# EAGLE design R3D2_long_range (EAGLE 7.4.0)
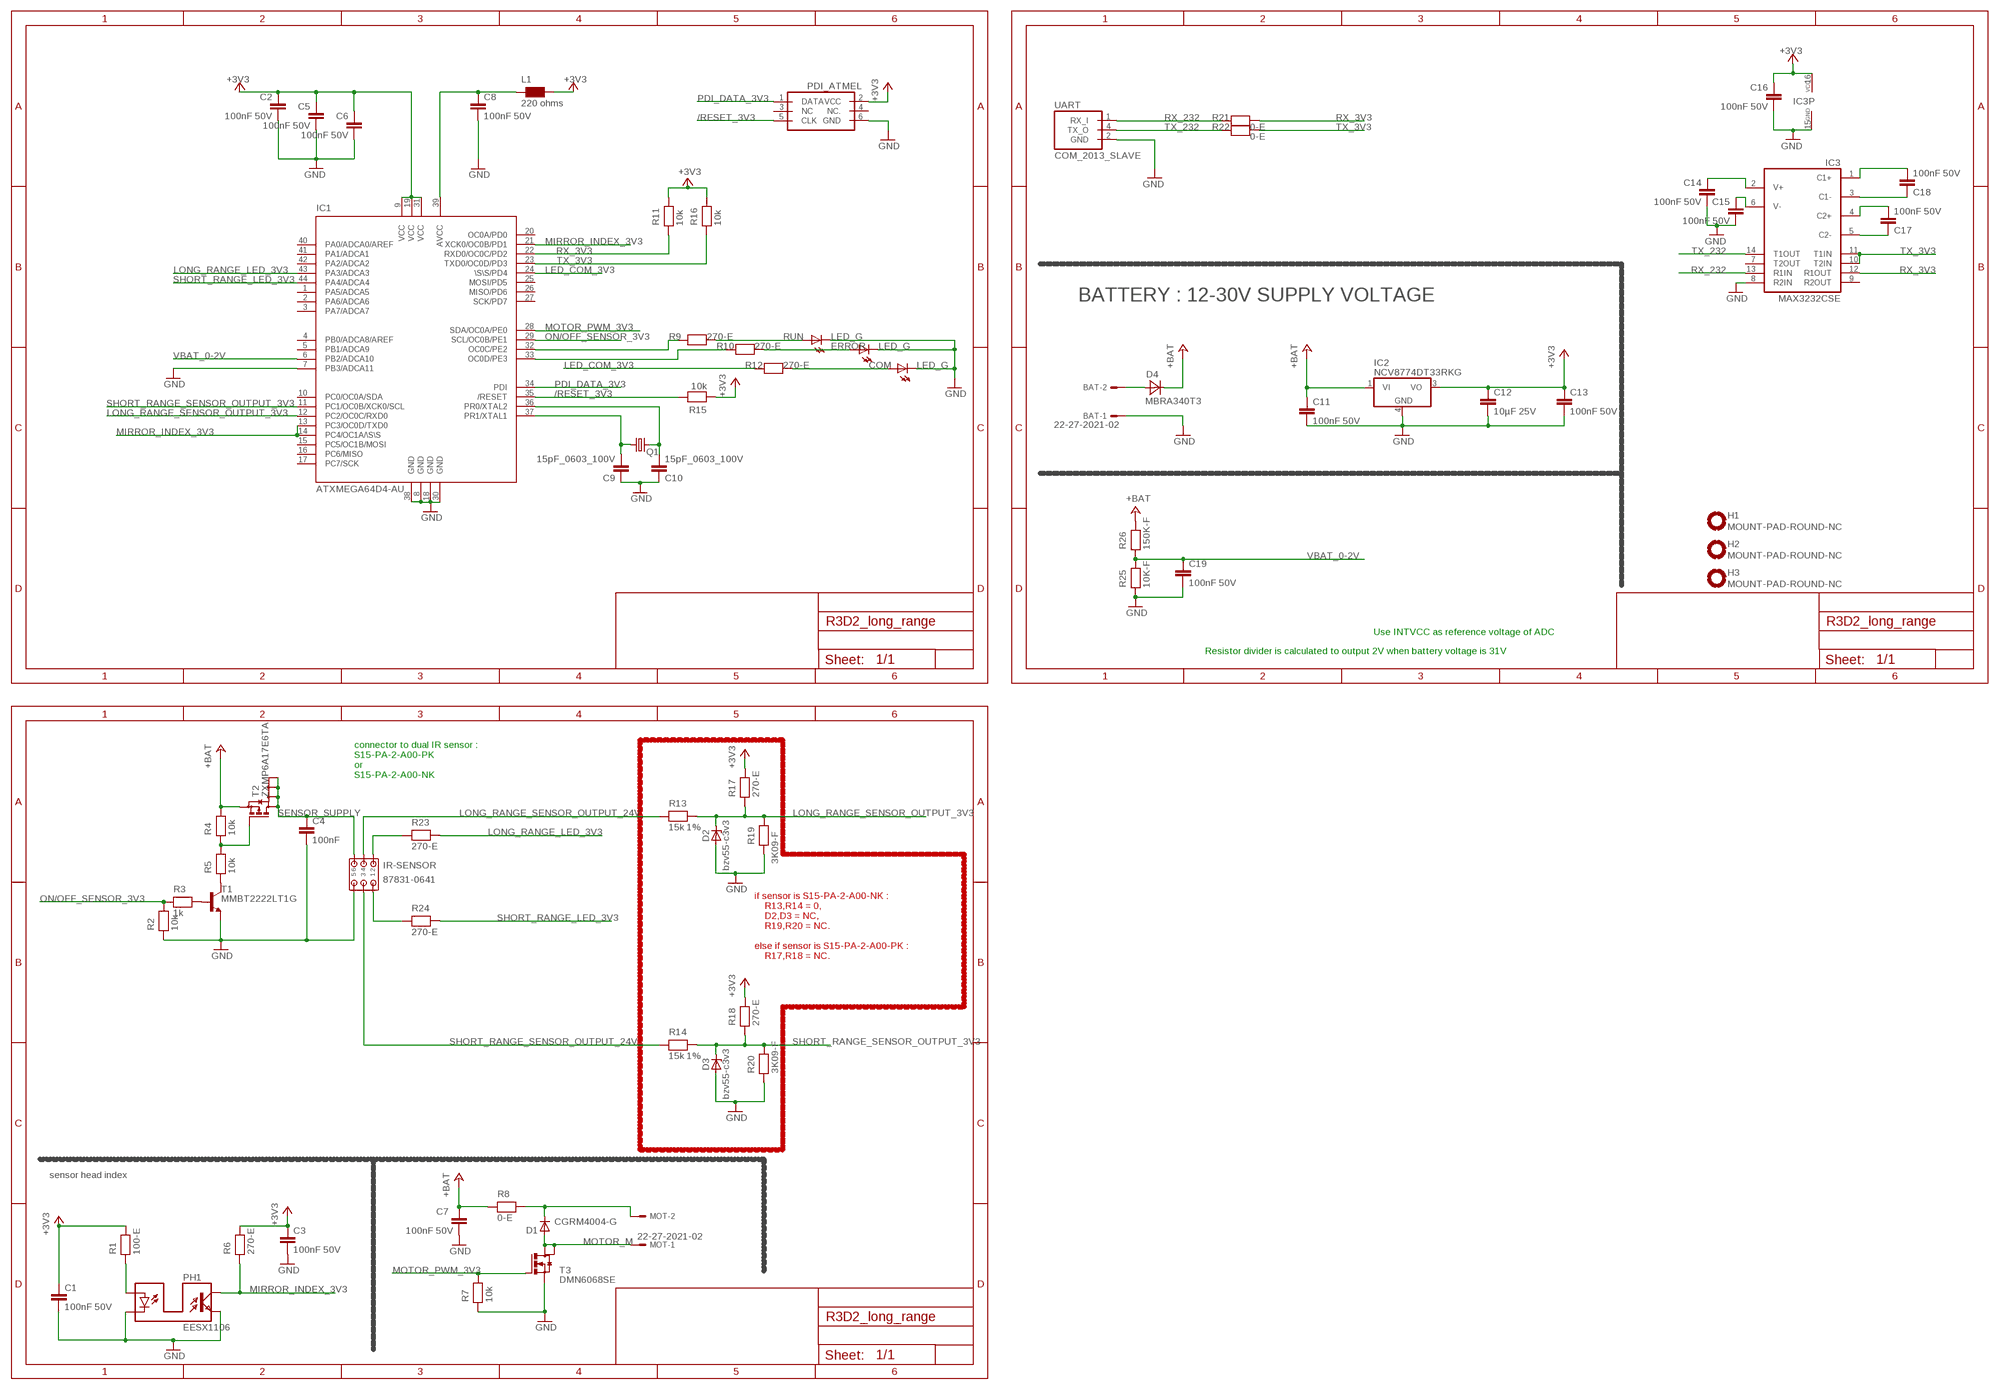
[diagram p0: schematic, sheet 1]

## Parts
BAT  22-27-2021-02  [6410-02]
C1  100nF 50V  100NF-F  [C0603]
C2  100nF 50V  100NF-F  [C0603]
C3  100nF 50V  100NF-F  [C0603]
C4  100nF  100NF-F  [C0603]
C5  100nF 50V  100NF-F  [C0603]
C6  100nF 50V  100NF-F  [C0603]
C7  100nF 50V  100NF-F  [C0603]
C8  100nF 50V  100NF-F  [C0603]
C9  15pF_0603_100V  15PF-F  [C0603]
C10  15pF_0603_100V  15PF-F  [C0603]
C11  100nF 50V  100NF-E  [C0805]
C12  10µF 25V  10UF-C_25V  [C1210]
C13  100nF 50V  100NF-F  [C0603]
C14  100nF 50V  100NF-F  [C0603]
C15  100nF 50V  100NF-F  [C0603]
C16  100nF 50V  100NF-F  [C0603]
C17  100nF 50V  100NF-F  [C0603]
C18  100nF 50V  100NF-F  [C0603]
C19  100nF 50V  100NF-E  [C0805]
COM  LED_G  [CHIP-LED0805]
D1  CGRM4004-G  [SOD-123_MINI-SMA]
D2  bzv55-c3v3  BZV55-C3V3SOD80C  [SOD80C]
D3  bzv55-c3v3  BZV55-C3V3SOD80C  [SOD80C]
D4  MBRA340T3  [SMA]
ERROR  LED_G  [CHIP-LED0805]
H1  MOUNT-PAD-ROUND-NC  [3,0-PAD_NC]
H2  MOUNT-PAD-ROUND-NC  [3,0-PAD_NC]
H3  MOUNT-PAD-ROUND-NC  [3,0-PAD_NC]
IC1  ATXMEGA64D4-AU  [TQFP44]
IC2  NCV8774DT33RKG  [DPACK_3]
IC3  MAX3232CSE  [SO16]
IR-SENSOR  87831-0641  [87831-0641]
L1  220 ohms  FERRITE_220OHMS  [R0603]
MOT  22-27-2021-02  [6410-02]
PDI_ATMEL  PDI_ATMELL  [ML6L]
PH1  EESX1106  [EESX1106]
Q1  CRYSTAL_16MHZ_5032  [CRYSTAL_5032]
R1  100-E  [R0805]
R2  10k  10K-F  [R0603]
R3  1k  1K-F  [R0603]
R4  10k  10K-F  [R0603]
R5  10k  10K-F  [R0603]
R6  270-E  [R0805]
R7  10k  10K-F  [R0603]
R8  0-E  [R0805]
R9  270-E  [R0805]
R10  270-E  [R0805]
R11  10k  10K-F  [R0603]
R12  270-E  [R0805]
R13  15k 1%  15K-F  [R0603]
R14  15k 1%  15K-F  [R0603]
R15  10k  10K-F  [R0603]
R16  10k  10K-F  [R0603]
R17  270-E  [R0805]
R18  270-E  [R0805]
R19  3K09-F  [R0603]
R20  3K09-F  [R0603]
R21  0-E  [R0805]
R22  0-E  [R0805]
R23  270-E  [R0805]
R24  270-E  [R0805]
R25  10K-F  [R0603]
R26  150K-F  [R0603]
RUN  LED_G  [CHIP-LED0805]
T1  MMBT2222LT1G  MMBT2222ALT1-NPN-SOT23-BEC  [SOT23-BEC]
T2  ZXMP6A17E6TA  [SOT26]
T3  DMN6068SE  [SOT223]
UART  COM_2013_SLAVE  [MICROMATCH-4_SMD]

## Nets
+3V3: C1.1 C2.1 C3.1 C5.1 C6.1 C12.1 C13.1 C16.1 IC1.9(VCC) IC1.19(VCC) IC1.31(VCC) IC2.3(VO) IC3.16(VCC) L1.2 PDI_ATMEL.2(VCC) R1.2 R6.2 R11.2 R15.1 R16.2 R17.2 R18.2
+24V: C7.1 C11.1 D4.C IC2.1(VI) R4.2 R8.1 R26.2 T2.4(S) ; supply symbol labelled +BAT
/RESET_3V3: IC1.35(/RESET) PDI_ATMEL.5(CLK) R15.2
GND: BAT.1 C1.2 C2.2 C3.2 C4.2 C5.2 C6.2 C7.2 C8.2 C9.1 C10.1 C11.2 C12.2 C13.2 C14.2 C15.2 C16.2 C19.2 COM.C D2.A D3.A ERROR.C IC1.7(PB3/ADCA11) IC1.8(GND) IC1.18(GND) IC1.30(GND) IC1.38(GND) IC2.4(GND) IC3.8(R2IN) IC3.15(GND) IR-SENSOR.5 PDI_ATMEL.6(GND) PH1.E(TRANSISTOR_E) PH1.K(LED_C) R2.1 R7.1 R19.1 R20.1 R25.1 RUN.C T1.E T3.3(S) UART.2(GND)
LED_COM_3V3: IC1.24(\S\S/PD4) R12.1
LONG_RANGE_LED_3V3: IC1.43(PA3/ADCA3) R23.2
LONG_RANGE_SENSOR_OUTPUT_3V3: D2.C IC1.12(PC2/OC0C/RXD0) R13.2 R17.1 R19.2
LONG_RANGE_SENSOR_OUTPUT_24V: IR-SENSOR.4 R13.1
MIRROR_INDEX_3V3: IC1.13(PC3/OC0D/TXD0) IC1.14(PC4/OC1A/\S\S) IC1.21(XCK0/OC0B/PD1) PH1.C(TRANSISTOR_C) R6.1
MOTOR_M: D1.A MOT.1 T3.2(D) T3.4(D)
MOTOR_PWM_3V3: IC1.28(SDA/OC0A/PE0) R7.2 T3.1(G)
N$1: C18.1 IC3.1(C1+)
N$2: R9.2 RUN.A
N$3: D1.C MOT.2 R8.2
N$4: ERROR.A R10.2
N$5: C18.2 IC3.3(C1-)
N$6: C17.1 IC3.4(C2+)
N$7: COM.A R12.2
N$8: BAT.2 D4.A
N$9: IC1.32(OC0C/PE2) R9.1
N$10: IC1.33(OC0D/PE3) R10.1
N$11: C14.1 IC3.2(V+)
N$13: C15.1 IC3.6(V-)
N$14: C10.2 IC1.36(PR0/XTAL2) Q1.2
N$15: PH1.A(LED_A) R1.1
N$16: C8.1 IC1.39(AVCC) L1.1
N$17: IR-SENSOR.2 R23.1
N$18: IR-SENSOR.1 R24.1
N$24: C17.2 IC3.5(C2-)
N$45: C9.2 IC1.37(PR1/XTAL1) Q1.1
N$113: R3.2 T1.B
N$126: R5.1 T1.C
N$128: R4.1 R5.2 T2.3(G)
ON/OFF_SENSOR_3V3: IC1.29(SCL/OC0B/PE1) R2.2 R3.1
PDI_DATA_3V3: IC1.34(PDI) PDI_ATMEL.1(DATA)
RX_3V3: IC1.22(RXD0/OC0C/PD2) IC3.12(R1OUT) R11.1 R21.2
RX_232: IC3.13(R1IN) R21.1 UART.1(RX_I)
SENSOR_SUPPLY: C4.1 IR-SENSOR.6 T2.1(D) T2.2(D) T2.5(D) T2.6(D)
SHORT_RANGE_LED_3V3: IC1.44(PA4/ADCA4) R24.2
SHORT_RANGE_SENSOR_OUTPUT_3V3: D3.C IC1.11(PC1/OC0B/XCK0/SCL) R14.2 R18.1 R20.2
SHORT_RANGE_SENSOR_OUTPUT_24V: IR-SENSOR.3 R14.1
TX_3V3: IC1.23(TXD0/OC0D/PD3) IC3.10(T2IN) IC3.11(T1IN) R16.1 R22.2
TX_232: IC3.14(T1OUT) R22.1 UART.4(TX_O)
VBAT_0-2V: C19.1 IC1.6(PB2/ADCA10) R25.2 R26.1
Unconnected: IC1.1(PA5/ADCA5) IC1.2(PA6/ADCA6) IC1.3(PA7/ADCA7) IC1.4(PB0/ADCA8/AREF) IC1.5(PB1/ADCA9) IC1.10(PC0/OC0A/SDA) IC1.15(PC5/OC1B/MOSI) IC1.16(PC6/MISO) IC1.17(PC7/SCK) IC1.20(OC0A/PD0) IC1.25(MOSI/PD5) IC1.26(MISO/PD6) IC1.27(SCK/PD7) IC1.40(PA0/ADCA0/AREF) IC1.41(PA1/ADCA1) IC1.42(PA2/ADCA2) IC3.7(T2OUT) IC3.9(R2OUT) PDI_ATMEL.3(NC) PDI_ATMEL.4(NC.)

## Notes on the sheet
- BATTERY : 12-30V SUPPLY VOLTAGE
- Use INTVCC as reference voltage of ADC
- Resistor divider is calculated to output 2V when battery voltage is 31V
- connector to dual IR sensor :
  S15-PA-2-A00-PK
  or 
  S15-PA-2-A00-NK
- if sensor is S15-PA-2-A00-NK :
      R13,R14 = 0,
      D2,D3 = NC,
      R19,R20 = NC.
  
  else if sensor is S15-PA-2-A00-PK :
      R17,R18 = NC.
- sensor head index

## Library data of the parts
BAT MOT = robotter_connector:22-?-02: CONNECTOR wire to board 2.54 mm (.1 inch) pitch header; MOUSER: 538-22-27-2021; RS: 483-8461
C1-C3 C5-C8 C13-C18 = robotter_capacitor:100NF; MOUSER: 81-GRM188F51H104ZA01; RS: 723-5534
C4 = robotter_capacitor:100NF; MOUSER: 81-GRM188F51H104ZA01; RS: 723-5534; VALUE: 100nF 50V
C9 C10 = robotter_capacitor:15PF; MOUSER: 581-06031A150K4T2A; RS: 147-421
C11 C19 = robotter_capacitor:100NF; MOUSER: 81-GRM40Y104Z50D; RS: 220-7966
C12 = robotter_capacitor:10UF; MOUSER: 963-TMK316BJ106KL-T; RS: 766-1185
COM ERROR RUN = robotter_diode:LED_; MOUSER: 859-LTST-C171GKT; RS: 692-0935; VALUE: GREEN
D1 = robotter_diode:CGRM400*-G: Molded plasitc,JEDEC SOD-123/Mini SMA Source: Comchip CGRM4001-G.pdf; MOUSER: 863-MRA4004T3G; RS: 545-2456; VALUE: MRA4004T3G
D2 D3 = robotter_diode:BZV55-C3V3: Z-Diode; MOUSER: 771-BZV55-C3V3T/R; RS: 748-5029
D4 = robotter_diode:MBRA340T3: Surface Mount Schottky Power Rectifier Source: http://www.onsemi.com/pub_link/Collateral/MBRA340T3-D.PDF; MOUSER: 863-MBRA340T3G; RS: 688-0502
H1-H3 = robotter_others:MOUNT-PAD-ROUND-NC
IC1 = robotter_ic:ATXMEGA64D4; MOUSER: 556-ATXMEGA64D4-AU; VALUE: ATXMEGA64DA-AU
IC2 = robotter_ic:NCV8774DT33RKG
IC3 = robotter_ic:MAX3232: True RS-232 Transceivers 3.0V to 5.5V, Low-Power up to 1Mbps, Using Four 0.1µF External Capacitors Source: http://pdfserv.maxim-ic.com/en/ds/MAX3222-MAX3241.pdf; MOUSER: 511-ST3232CDR; RS: 415-2105
IR-SENSOR = robotter_connector:87831-0641; FARNELL: 1393817
L1 = robotter_inductor:FERRITE_220OHMS; MOUSER: 81-BLM18BB221SN1D; RS: 724-1302
PDI_ATMEL = robotter_connector:PDI_ATMEL: Ref Harting : 09 18 506 7323 Atmel pdi connector; MOUSER: 617-09-18-506-7323; RS: 693-5242
PH1 = robotter_ic:EESX1106
Q1 = robotter_ic:CRYSTAL_: CRYSTAL; FARNELL: 2467791
R1 = robotter_resistor:100; MOUSER: 603-AF0805FR-07100RL; RS: 223-0297
R2 R4 R5 R7 R11 R15 R16 R25 = robotter_resistor:10K; MOUSER: 652-CR0603-JW-103ELF; RS: 740-8899
R3 = robotter_resistor:1K; MOUSER: 71-CRCW0603-1.0K-E3; RS: 213-2266
R6 R9 R10 R12 R17 R18 R23 R24 = robotter_resistor:270; MOUSER: 660-RK73H2ATTD2700F; RS: 740-9019
R8 R21 R22 = robotter_resistor:0
R13 R14 = robotter_resistor:15K; MOUSER: 652-CR0603-JW-153GLF; RS: 740-8912
R19 R20 = robotter_resistor:3K09; MOUSER: 667-ERA-3AEB3091V; RS: 708-7574
R26 = robotter_resistor:150K; FARNELL: 1527709; RS: 213-2553
T1 = robotter_ic:*-NPN-: NPN Transistror; MOUSER: 863-MMBT2222ALT1G; RS: 544-9400; VALUE: mmbt2222
T2 = robotter_ic:ZXMP6A17E6TA; FN: 1843775
T3 = robotter_ic:DMN6068SE; FARNELL: 2061415
UART = robotter_connector:COM_2013_SLAVE; MOUSER: 571-7-188275-4; RS: 366-1721

## Board
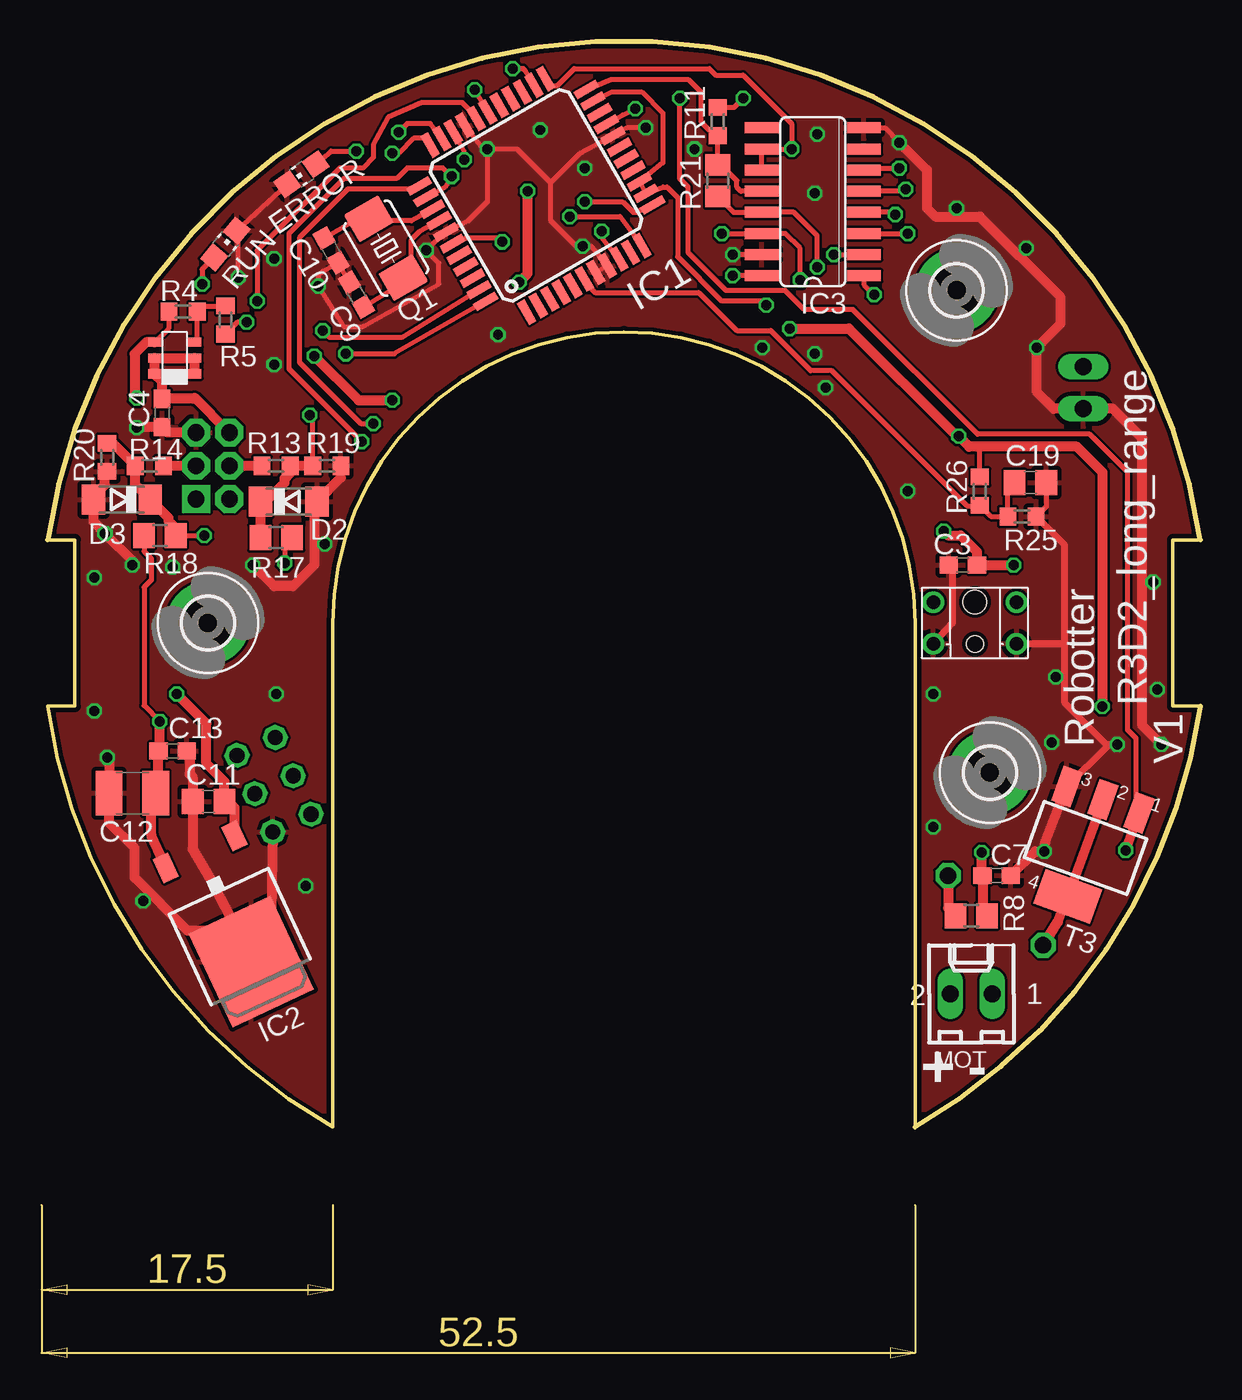
[diagram p1: board, top side]
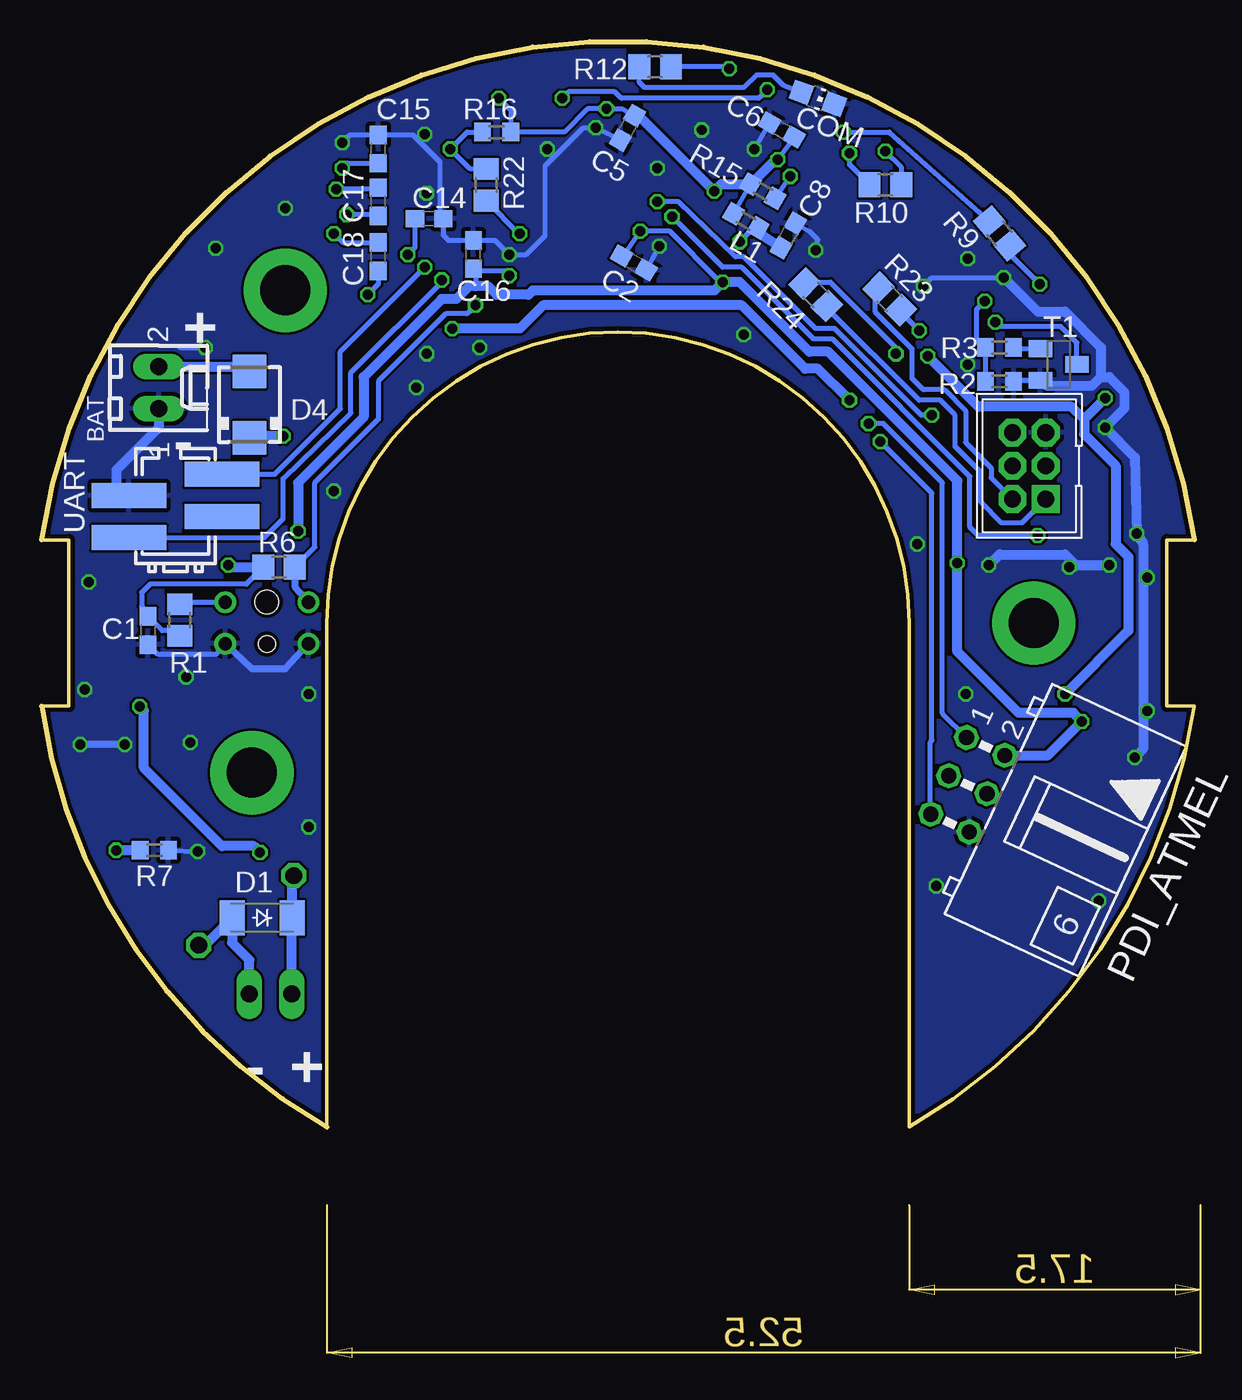
[diagram p2: board, bottom side, seen from below]

Size 69.28 x 65.27 mm. Coordinates in mm from the lower left corner, seen from the top.
Outline: 69.24,35.31 67.64,35.31 67.64,25.31 69.24,25.31
Outline: 0.04,25.31 1.64,25.31 1.64,35.31 0.04,35.31
Outline: 0,25.31 arc52 17.14,0 17.14,30.31 arc-180 52.14,30.31 52.14,0 arc52 69.28,25.31
Outline: 69.28,35.31 arc164 0,35.31
Copper layers (1*16): Top 0.035mm / dielectric 1.5mm / Bottom 0.035mm
Design rules "Elecrow_2-layer_eagle_rule *": minimum track width 6mil, minimum drill 12mil, track to track 6mil, track to pad 6mil, pad to pad 6mil, via to via 6mil, smd to smd 0mil, copper to edge 10mil, drill to drill 10mil, minimum pad ring 10mil, minimum via ring 6mil, stop-mask expansion 2mil, vias tented up to drill 100mil, thermal gap 10mil

### Footprints (pad centres in the part's own frame; a part is rotated, then mirrored left to right if it is on the bottom)
6410-02 = drill 1.016 long: 1 1.27,0; 2 -1.27,0
C0603 = smd 1.1 x 1: 1 -0.85,0; 2 0.85,0
C0805 = smd 1.3 x 1.5: 1 -0.95,0; 2 0.95,0
C1210 = smd 1.6 x 2.7: 1 -1.4,0; 2 1.4,0
CHIP-LED0805 = smd 1.2 x 1.2: A 0,-1.05; C 0,1.05
SOD-123_MINI-SMA = smd 1.5 x 2.1: A 1.8,0; C -1.8,0
SOD80C = smd 1.4 x 1.8: A 1.7,0; C -1.7,0
SMA = smd 2 x 2: A 2,0; C -2,0
3,0-PAD_NC = drill 3 pad 5: B3,0 0,0
TQFP44 = smd 1.5 x 0.5: 1 -5.8,4; 2 -5.8,3.2; 3 -5.8,2.4; 4 -5.8,1.6; 5 -5.8,0.8; 6 -5.8,0; 7 -5.8,-0.8; 8 -5.8,-1.6; 9 -5.8,-2.4; 10 -5.8,-3.2; 11 -5.8,-4; 23 5.8,-4; 24 5.8,-3.2; 25 5.8,-2.4; 26 5.8,-1.6; 27 5.8,-0.8; 28 5.8,0; 29 5.8,0.8; 30 5.8,1.6; 31 5.8,2.4; 32 5.8,3.2; 33 5.8,4 | smd 0.5 x 1.5: 12 -4,-5.8; 13 -3.2,-5.8; 14 -2.4,-5.8; 15 -1.6,-5.8; 16 -0.8,-5.8; 17 0,-5.8; 18 0.8,-5.8; 19 1.6,-5.8; 20 2.4,-5.8; 21 3.2,-5.8; 22 4,-5.8; 34 4,5.8; 35 3.2,5.8; 36 2.4,5.8; 37 1.6,5.8; 38 0.8,5.8; 39 0,5.8; 40 -0.8,5.8; 41 -1.6,5.8; 42 -2.4,5.8; 43 -3.2,5.8; 44 -4,5.8
DPACK_3 = smd 1 x 1.6: 1 -2.28,-4.8; 3 2.28,-4.8 | smd 5.4 x 6.2: 4 0,2.5
SO16 = smd 0.66 x 2.032: 1 -4.445,-3.073; 2 -3.175,-3.073; 3 -1.905,-3.073; 4 -0.635,-3.073; 5 0.635,-3.073; 6 1.905,-3.073; 7 3.175,-3.073; 8 4.445,-3.073; 9 4.445,3.073; 10 3.175,3.073; 11 1.905,3.073; 12 0.635,3.073; 13 -0.635,3.073; 14 -1.905,3.073; 15 -3.175,3.073; 16 -4.445,3.073
87831-0641 = drill 1 pad 1.676 square: 1 -2,-1 | drill 1 pad 1.676 octagon: 2 -2,1; 3 0,-1; 4 0,1; 5 2,-1; 6 2,1
R0603 = smd 1 x 1.1: 1 -0.85,0; 2 0.85,0
ML6L = drill 0.914 octagon: 1 -2.54,-1.27; 2 -2.54,1.27; 3 0,-1.27; 4 0,1.27; 5 2.54,-1.27; 6 2.54,1.27
EESX1106 = drill 0.8: A 2.5,1.25; C -2.5,1.25; E -2.5,-1.25; K 2.5,-1.25 | hole 1.4: 0,1.27 | hole 1: 0,-1.27
CRYSTAL_5032 = smd 1.9 x 2.4: 1 -2.05,0; 2 2.05,0
R0805 = smd 1.3 x 1.5: 1 -0.95,0; 2 0.95,0
SOT23-BEC = smd 1 x 1.4: B -0.95,-1.1; C 0,1.1; E 0.95,-1.1
SOT26 = smd 0.55 x 0.8: 1 -0.95,-1.2; 2 0,-1.2; 3 0.95,-1.2; 4 0.95,1.2; 5 0,1.2; 6 -0.95,1.2
SOT223 = smd 1.219 x 2.235: 1 -2.311,-3.099; 2 0,-3.099; 3 2.311,-3.099 | smd 3.6 x 2.2: 4 0,3.099
MICROMATCH-4_SMD = smd 1.5 x 4.5: 1 1.905,-2.794; 2 0.635,2.794; 3 -0.635,-2.794; 4 -1.905,2.794

### Placement (x,y rotation side)
BAT  62.25,44.46 270 bottom
C1  62.89,29.85 270 bottom
C2  33.68,51.95 330 bottom
C3  55.01,33.79 180 top
C4  6.88,42.94 270 top
C5  34.06,60.08 240 bottom
C6  24.79,59.95 150 bottom
C7  57.05,15.12 0 top
C8  24.41,53.6 60 bottom
C9  18.56,50.05 300 top
C10  17.04,52.72 120 top
C11  9.67,19.57 180 top
C12  5.1,20.08 180 top
C13  7.51,22.62 0 top
C14  46,54.62 0 bottom
C15  49.04,58.81 90 bottom
C16  43.33,52.46 90 bottom
C17  49.04,55.64 90 bottom
C18  49.04,52.33 90 bottom
C19  59.08,38.74 0 top
COM  22.63,61.86 250 bottom
D1  56.03,12.58 180 bottom
D2  14.5,37.6 0 top
D3  4.47,37.73 180 top
D4  56.79,43.44 90 bottom
ERROR  15.26,57.29 125 top
H1  56.64,21.31 0 top
H2  54.64,50.31 0 top
H3  9.64,30.31 0 top
IC1  29.36,56.02 120 top
IC2  11.2,12.2 205 top
IC3  46,55.64 90 top
IR-SENSOR  9.93,39.76 90 bottom
L1  26.95,54.49 150 bottom
MOT  55.52,8.01 0 top
PDI_ATMEL  13.61,20.58 245 bottom
PH1  55.74,30.31 0 top
Q1  20.34,52.84 120 top
R1  60.98,30.49 270 bottom
R2  11.71,44.84 180 bottom
R3  11.71,46.87 0 bottom
R4  8.15,49.03 180 top
R5  10.69,48.52 90 top
R6  55.01,33.66 180 bottom
R7  62.51,16.65 180 bottom
R8  55.52,12.71 180 top
R9  11.71,53.73 310 bottom
R10  18.56,56.65 0 bottom
R11  40.28,60.46 90 top
R12  32.41,63.76 180 bottom
R13  13.74,39.76 0 top
R14  6.12,39.76 180 top
R15  25.93,56.27 330 bottom
R16  41.93,59.83 0 bottom
R17  13.74,35.44 0 top
R18  6.75,35.57 180 top
R19  16.79,39.76 180 top
R20  3.58,40.27 90 top
R21  40.28,56.91 90 top
R22  42.57,56.65 90 bottom
R23  18.31,49.79 315 bottom
R24  22.76,50.05 135 bottom
R25  58.57,36.71 180 top
R26  56.03,38.24 90 top
RUN  10.69,53.1 320 top
T1  8.15,45.86 270 bottom
T2  7.64,46.24 90 top
T3  62.38,16.77 160 top
UART  61.24,37.35 90 bottom

### Tracks (layer width: path | path; a pad name or v marks a point on that pad's centre or on a via)
+3V3  (via drill 0.6)
  Top 0.305: 6.75,22.7 C13.1 | R18.2 5.8,34.62 6.25,34.17 6.25,32.9 5.8,32.46 5.8,25.34 v6.75,24.39 | IC3.16 v41.17,51.19 | R11.2 41.26,61.31 v41.8,61.86 | R17.2 14.25,35 v14.25,33.92 | IC1.19 34.57,60.84 v35.33,61.22 | v25.04,58.18 25.04,58.68 IC1.31 | IC1.9 33.3,53.49 v33.3,53.86
  Top 0.61: IC2.3 6.98,15.92 6.25,17.54 6.25,19.7 C12.1 6.67,20.24 C13.1 | 6.75,22.7 v6.75,24.39 | v28.34,50.81 28.85,51.32 v28.85,56.27 | v53.87,35.82 54.12,35.57 54.89,35.57 55.86,34.59 C3.1 v58.06,33.79
  Bottom 0.305: 7.21,23.93 v6.75,24.39 | v41.8,61.86 41.08,61.14 R16.2 37.87,59.83 36.47,61.22 v35.33,61.22 34.42,61.22 C5.1 | C6.1 v25.04,58.18 | L1.2 R15.1 | C2.1 34.16,52.61 v33.3,53.86 31.52,53.86 28.6,50.94 v28.34,50.81 | C16.1 43.2,51.48 | 43.2,51.48 43.2,50.56 | 43.2,51.48 41.46,51.48 v41.17,51.19 | R6.2 56.98,32.65 62.76,32.65 63.27,32.14 63.27,31.31 62.89,30.93 C1.1 62.04,29.85 61.11,29.85 60.98,29.73 R1.2
  Bottom 0.61: PDI_ATMEL.2 8.8,22.35 v6.75,24.39 7.26,24.9 10.56,24.9 14.25,28.59 v14.25,33.92 14.25,38.87 21.99,46.62 23.14,46.62 27.33,50.81 v28.34,50.81 28.85,50.3 39.77,50.3 40.03,50.05 41.93,50.05 42.44,50.56 43.2,50.56 43.58,50.56 44.34,49.79 45.23,49.79 49.93,45.09 49.93,42.68 53.87,38.74 v53.87,35.82 | v25.04,58.18 25.19,58.18 R15.1 28.43,56.7 v28.85,56.27 33.4,60.82 C5.1 | v58.06,33.79 57.93,33.66 R6.2
+24V  (via drill 0.6)
  Top 0.305: T2.4 7.3,48.05 R4.2 | R26.2 56.03,40.78 55.9,40.9
  Top 0.61: R8.1 56.47,12.9 56.2,13.18 C7.1 56.16,15.16 v56.16,16.52 | IC2.1 11.24,19.21 C11.1 10.62,20.78 9.55,21.85 9.55,24.27 v7.77,26.05 | T2.4 5.92,47.19 5.23,46.49 5.23,43.95 v5.36,43.83 | v16.02,46.37 18.69,43.7 v20.72,43.7 | v63.39,25.28 63.39,39.38 61.87,40.9 55.9,40.9 55.39,40.9 v54.76,41.54 54.63,41.54 48.16,48.02 v44.6,48.02
  Bottom 0.61: v7.77,26.05 3.96,29.85 3.96,34.3 4.72,35.06 4.72,39.76 6.63,41.67 6.63,42.55 | 6.63,42.55 7.39,43.32 12.98,43.32 v16.02,46.37 | v56.16,16.52 56.54,16.9 58.44,16.9 63.14,21.6 63.14,25.03 v63.39,25.28 | v54.76,41.54 56.7,41.54 D4.C | 6.63,42.55 v5.36,43.83 | v20.72,43.7 22.63,45.6 23.39,45.6 27.2,49.41 39.14,49.41 40.53,48.02 v44.6,48.02
/RESET_3V3  (via drill 0.6)
  Top 0.305: IC1.35 23.9,56.52 v24.28,57.16 23.77,57.67 21.61,57.67 20.98,57.03 17.8,57.03 14.5,53.73 14.5,45.6 v18.88,41.22
  Bottom 0.305: v18.88,41.22 15.77,38.11 15.77,23.25 15.9,23.12 15.9,19.44 15.83,19.38 PDI_ATMEL.5 | v24.28,57.16 R15.2
GND  (via drill 0.6)
  Top 0.305: C9.1 C10.1 16.53,51.45 16.28,51.19 v16.28,50.56 17.8,48.14 18.95,48.14 23.52,50.68 23.52,51.95 v22.76,52.72 IC1.38 25.3,54.49 26.44,55.64 v26.44,58.81 | IC3.15 v41.17,52.46 | IC3.8 50.31,60.08 v51.2,59.19 | ERROR.C RUN.C 11.45,53.81 v11.45,51.06 | v35.96,60.08 34.82,60.08 IC1.18 32.03,58.56 30.25,56.78 | v26.44,58.81 26.18,58.81 IC1.30 | IC1.7 IC1.8 32.69,52.94 32.18,52.94 v32.15,52.97 31.77,52.97 30.25,54.49 30.25,56.78 | 30.25,56.78 28.22,58.81 v26.44,58.81 | C19.2 60.03,37.32 R25.1 | C3.2 54.16,33.75
  Top 0.406: T3.3 63.72,22.93 | 63.72,22.93 63.79,23 v64.28,23 | 61.11,29.09 61.11,35.02 R25.1 | 61.11,29.09 61.11,25.54 63.72,22.93 | PH1.K 61.08,29.06 61.11,29.09 | 54.16,33.75 54.38,33.54 54.38,30.3 PH1.E
  Top 0.61: T3.3 59.97,17.16 v59.9,16.58 59.36,16.58 C7.2 | PDI_ATMEL.6 13.41,11.34 IC2.4 12.02,10.64 | 12.02,10.64 9.8,14.87 8.72,16.71 C11.2 8.72,21.03 8.53,21.22 8.53,22.45 C13.2 | 12.02,10.64 11.35,11.31 10.56,11.31 10.05,11.82 8.4,11.82 5.23,15 5.23,16.77 3.7,18.3 C12.2 3.7,22.11 v3.58,22.23 | R20.1 3.45,39.29 3.45,38.62 2.77,37.93 D3.A 2.77,36.38 v3.45,35.7 5.23,33.92 v5.1,33.79 | IR-SENSOR.5 7.21,41.76 C4.2 5.39,42.09 v5.36,42.05 | R19.1 17.64,39.04 D2.A 16.02,37.43 16.02,33.79 14.75,32.52 13.61,32.52 v12.34,33.79 | v66.95,23 65.81,24.14 65.81,41.41 64.03,43.19 BAT.1 60.47,43.19 59.46,44.21 v59.46,46.87 60.85,48.27 60.85,49.92 56.03,54.75 53.36,54.75 52.85,55.26 52.85,57.54 v51.2,59.19
  Bottom 0.305: v22.76,52.72 22.63,53.35 23.14,53.86 C8.2 | R7.1 61.62,16.65 v59.9,16.58 | R2.1 10.79,44.91 T1.E | v51.2,59.19 50.73,59.66 C15.2 46.97,59.66 45.36,58.05 45.36,54.84 C14.2 45.15,53.64 44.81,53.31 C16.2 42.02,53.31 v41.17,52.46 40.15,52.46 39.01,53.6 39.01,57.8 36.73,60.08 v35.96,60.08 C5.2 | 60.98,46.87 v59.46,46.87 | C6.2 v26.44,58.81 | C2.2 v32.15,52.97 | v16.28,50.56 15.77,51.06 v11.45,51.06 | C1.2 62.34,28.46 58.74,28.46 PH1.K
  Bottom 0.406: v64.28,23 v66.95,23 | PH1.K 56.65,27.57 54.63,27.57 PH1.E
  Bottom 0.61: BAT.1 62.25,42.05 64.79,39.51 64.79,38.24 UART.2 | v12.34,33.79 11.71,34.43 7.77,34.43 7.13,33.79 v5.1,33.79 | v3.58,22.23 3.07,22.74 3.07,35.06 v3.45,35.7 3.58,40.27 v5.36,42.05 4.21,43.19 4.21,44.21 5.1,45.09 5.61,45.09 | 5.61,45.09 5.61,46.87 7.77,49.03 9.42,49.03 v11.45,51.06 | T1.E 8.91,44.59 6.12,44.59 5.61,45.09
  other vias: 13.61,52.21 13.61,45.86 38.88,58.81 54.63,55.26 58.82,52.84 66.7,26.3 66.44,32.78 60.6,27.06 53.23,26.05 53.23,18.04 60.35,23.12 7.51,33.66 2.82,33.03 2.82,25.03 13.74,26.05 5.74,13.6 15.52,14.49 29.61,59.95 32.28,57.67 46.25,59.7 46.12,56.14 16.66,35.06 27.07,47.63 42.95,46.87 46.76,44.46 51.71,38.24 46.12,46.49
  pour Top: 0.15,-0.5 70,-0.5 70,50.17 70,65.8 2.69,65.8 0.15,65.8
  pour Bottom: 0.15,-0.5 70,-0.5 70,50.17 70,65.8 2.69,65.8 0.15,65.8
LED_COM_3V3  (via drill 0.6)
  Top 0.305: IC1.24 28.72,63.51 28.6,63.64 v27.96,63.64
  Bottom 0.305: v27.96,63.64 28.09,63.76 R12.1
LONG_RANGE_LED_3V3  (via drill 0.6)
  Top 0.305: v16.53,47.89 16.91,47.51 21.36,47.51 IC1.43
  Bottom 0.305: R23.2 17.64,48.99 v16.53,47.89
LONG_RANGE_SENSOR_OUTPUT_3V3  (via drill 0.6)
  Top 0.305: R19.2 15.94,42.64 v15.77,42.81 | v32.28,55.64 34.57,55.64 35.2,55 35.45,55 IC1.12
  Top 0.61: R19.2 R13.2 14.59,39.34 14.25,39 14.25,38.74 13.18,37.68 D2.C 12.79,37.59 R17.1
  Bottom 0.305: v15.77,42.81 16.41,42.81 21.61,48.02 22.76,48.02 27.07,52.33 27.58,52.33 31.01,55.64 v32.28,55.64
LONG_RANGE_SENSOR_OUTPUT_24V
  Top 0.61: IR-SENSOR.4 R13.1
MIRROR_INDEX_3V3  (via drill 0.6)
  Top 0.305: IC1.21 33.93,62.24 35.71,62.24 36.98,60.97 36.98,57.98 IC1.14 IC1.13 37,56.52 | 37,56.52 36.98,56.52 | 37,56.52 37.23,56.52 37.87,55.89 37.87,52.33 40.53,49.67 42.95,49.67 v43.2,49.41
  Bottom 0.305: v43.2,49.41 43.71,48.91 44.98,48.91 49.04,44.84 49.04,42.55 52.85,38.74 52.85,34.87 R6.1
  Bottom 0.406: R6.1 54.06,32.48 PH1.C
MOTOR_M  (via drill 1)
  Top 0.61: v59.84,10.93 60.73,12.33 T3.4 T3.2
  Bottom 0.61: MOT.1 56.79,10.04 57.83,11.08 D1.A 59.48,10.93 v59.84,10.93
MOTOR_PWM_3V3  (via drill 0.6)
  Top 0.305: T3.1 65.43,19.08 65.43,23.38 64.92,23.89 64.92,39.38 62.63,41.67 55.9,41.67 48.41,49.16 45.49,49.16 44.34,50.3 40.79,50.3 38.5,52.59 38.5,56.52 37.99,57.03 v37.99,61.86 | IC1.28 v25.68,62.37
  Top 0.61: v64.79,16.65 T3.1
  Bottom 0.305: v25.68,62.37 26.18,61.86 34.44,61.86 34.82,62.24 37.61,62.24 v37.99,61.86
  Bottom 0.61: R7.2 v64.79,16.65
N$1  (via drill 0.6)
  Top 0.305: IC3.1 49.07,50.66 v49.68,50.05
  Bottom 0.305: C18.1 49.04,50.68 v49.68,50.05
N$2  (via drill 0.6)
  Top 0.305: RUN.A 9.29,51.57 v9.29,50.68
  Bottom 0.305: v9.29,50.68 11.1,52.48 R9.2
N$3  (via drill 1)
  Top 0.61: v54.12,15.12 54.12,13.16 R8.2
  Bottom 0.61: v54.12,15.12 54.23,15.02 D1.C 54.25,12.56 MOT.2
N$4  (via drill 0.6)
  Top 0.305: ERROR.A 17.04,58.68 v18.56,58.68
  Bottom 0.305: v18.56,58.68 17.61,57.73 R10.2
N$5  (via drill 0.6)
  Top 0.305: IC3.3 v51.71,53.73
  Bottom 0.305: v51.71,53.73 51.16,53.18 C18.2
N$6  (via drill 0.6)
  Top 0.305: v50.95,54.87 50.95,55 IC3.4
  Bottom 0.305: C17.1 49.13,54.87 v50.95,54.87
N$7
  Bottom 0.305: COM.A 24.66,62.62 25.3,63.26 26.31,63.26 27.07,62.49 33.04,62.49 33.36,62.81 R12.2
N$8
  Bottom 0.61: BAT.2 57.08,45.73 D4.A
N$9  (via drill 0.6)
  Top 0.305: IC1.32 23.01,60.34 21.61,60.34 v21.1,59.83
  Bottom 0.305: v21.1,59.83 18.32,59.83 R9.1
N$10  (via drill 0.6)
  Top 0.305: IC1.33 22.63,59.45 21.99,59.45 21.1,58.56 v20.72,58.56
  Bottom 0.305: R10.1 20.72,57.86 v20.72,58.56
N$11  (via drill 0.6)
  Top 0.305: v47.27,52.46 IC3.2
  Bottom 0.305: C14.1 46.85,52.88 v47.27,52.46
N$13  (via drill 0.6)
  Top 0.305: IC3.6 49.2,57.67 v51.2,57.67
  Bottom 0.305: v51.2,57.67 50.91,57.96 C15.1
N$14
  Top 0.305: IC1.36 21.87,54.49 20.6,54.49 20.47,54.62 Q1.2 arc87 18.82,54.75 C10.2
N$15
  Bottom 0.305: R1.1 60.86,31.56 PH1.A
N$16  (via drill 0.6)
  Top 0.305: 24.36,53.1 25.17,53.48 27.07,53.48 v27.33,53.22
  Top 0.406: IC1.39 24.36,53.1
  Bottom 0.305: v27.33,53.22 26.69,53.86 26.24,53.86 26.21,53.83 L1.1
  Bottom 0.61: C8.1 25.93,53.6 arc50 L1.1
N$17
  Bottom 0.305: IR-SENSOR.2 12.21,39.05 12.21,39.63 13.74,41.16 13.74,43.06 15.01,44.33 16.28,44.33 16.98,45.03 16.98,46.81 19.2,49.03 19.2,50.25 R23.1
N$18
  Bottom 0.305: IR-SENSOR.1 10.36,36.33 11.58,36.33 12.85,37.6 12.85,39.38 14.37,40.9 14.37,42.81 15.26,43.7 16.53,43.7 22.08,49.25 R24.1 | R24.1
N$24  (via drill 0.6)
  Top 0.305: v51.58,56.4 51.46,56.27 IC3.5
  Bottom 0.305: C17.2 49.13,56.4 v51.58,56.4
N$45
  Top 0.305: IC1.37 22.37,53.86 21.87,53.35 21.87,51.57 Q1.1 arc-40 20.85,50.43 C9.2
N$113
  Bottom 0.305: R3.2 10.79,46.81 T1.B
N$126  (via drill 0.6)
  Top 0.305: v11.96,48.4 11.41,48.4 R5.1
  Bottom 0.305: T1.C 7.05,47.17 8.02,48.14 11.71,48.14 v11.96,48.4
N$128
  Top 0.305: T2.3 9,47.35 R4.1 9.34,49.37 R5.2
ON/OFF_SENSOR_3V3  (via drill 0.6)
  Top 0.305: v12.6,49.67 12.6,52.72 17.55,57.67 18.95,57.67 19.58,58.3 19.58,59.06 20.47,60.72 22.5,61.6 24.91,61.6 25.77,60.75 IC1.29
  Bottom 0.305: R2.2 R3.1 13.1,47.42 13.1,49.16 v12.6,49.67
PDI_DATA_3V3  (via drill 0.6)
  Top 0.305: IC1.34 21.61,56.4 18.06,56.4 15.13,53.48 15.13,45.98 18.82,42.3 v19.58,42.3
  Bottom 0.305: PDI_ATMEL.1 15.13,24.87 15.13,38.74 18.69,42.3 v19.58,42.3
RX_3V3
  Top 0.305: IC3.12 41.68,56.27 41.42,56.52 41.42,56.91 40.47,57.86 R21.2 R11.1 39.94,59.95 39.77,59.95 39.27,60.46 39.27,62.24 38.5,63 33.89,63 IC1.22
RX_232  (via drill 0.6)
  Top 0.305: v46.25,51.7 46.25,53.6 44.85,55 IC3.13 41.24,55 R21.1
  Bottom 0.305: UART.1 55.27,39.25 51.33,43.19 51.33,46.62 v46.25,51.7
SENSOR_SUPPLY
  Top 0.61: T2.1 T2.2 T2.5 T2.6 6.88,44.85 C4.1 8.78,43.79 8.84,43.85 IR-SENSOR.6
SHORT_RANGE_LED_3V3  (via drill 0.6)
  Top 0.305: v17.93,46.49 20.85,46.49 IC1.44
  Bottom 0.305: R24.2 23.34,50.81 21.87,50.81 17.93,46.87 v17.93,46.49
SHORT_RANGE_SENSOR_OUTPUT_3V3  (via drill 0.6)
  Top 0.305: R18.1 v9.42,35.57 | v31.39,54.75 34.41,54.75 IC1.11
  Top 0.61: R20.2 3.91,41.12 R14.2 5.27,38.63 D3.C 7.26,36.63 7.26,36.46 7.7,36.02 R18.1
  Bottom 0.305: v9.42,35.57 12.98,35.57 13.48,36.08 13.48,39.13 21.74,47.38 22.88,47.38 27.2,51.7 28.34,51.7 v31.39,54.75
SHORT_RANGE_SENSOR_OUTPUT_24V
  Top 0.61: R14.1 IR-SENSOR.3
TX_3V3  (via drill 0.6)
  Top 0.305: IC3.11 IC3.10 v44.73,58.81 44.73,60.34 41.8,63.26 40.15,63.26 39.77,63.64 31.64,63.64 30.63,62.62 30.34,62.62 IC1.23
  Bottom 0.305: R16.1 43.71,59.83 v44.73,58.81 43.52,57.6 R22.2
TX_232  (via drill 0.6)
  Top 0.305: v45.23,50.94 45.23,52.84 44.34,53.73 IC3.14 v40.53,53.73
  Bottom 0.305: UART.4 55.9,35.44 54.76,36.59 54.76,39 50.7,42.94 50.7,45.35 45.23,50.81 v45.23,50.94 | R22.1 40.6,53.73 v40.53,53.73
VBAT_0-2V
  Top 0.305: IC1.6 32.41,50.85 32.41,50.68 32.91,50.17 39.14,50.17 41.42,47.89 43.46,47.89 45.87,45.48 47.14,45.48 55.27,37.35 55.99,37.35 R26.1 56.7,36.71 R25.2 57.72,38.34 C19.1

### Text on the board
tPlace: R3D2_long_range | Robotter | V1 | + | -
bPlace: + | - | + | -